# Altium schematic sheet DongHoInternet.SchDoc
size A
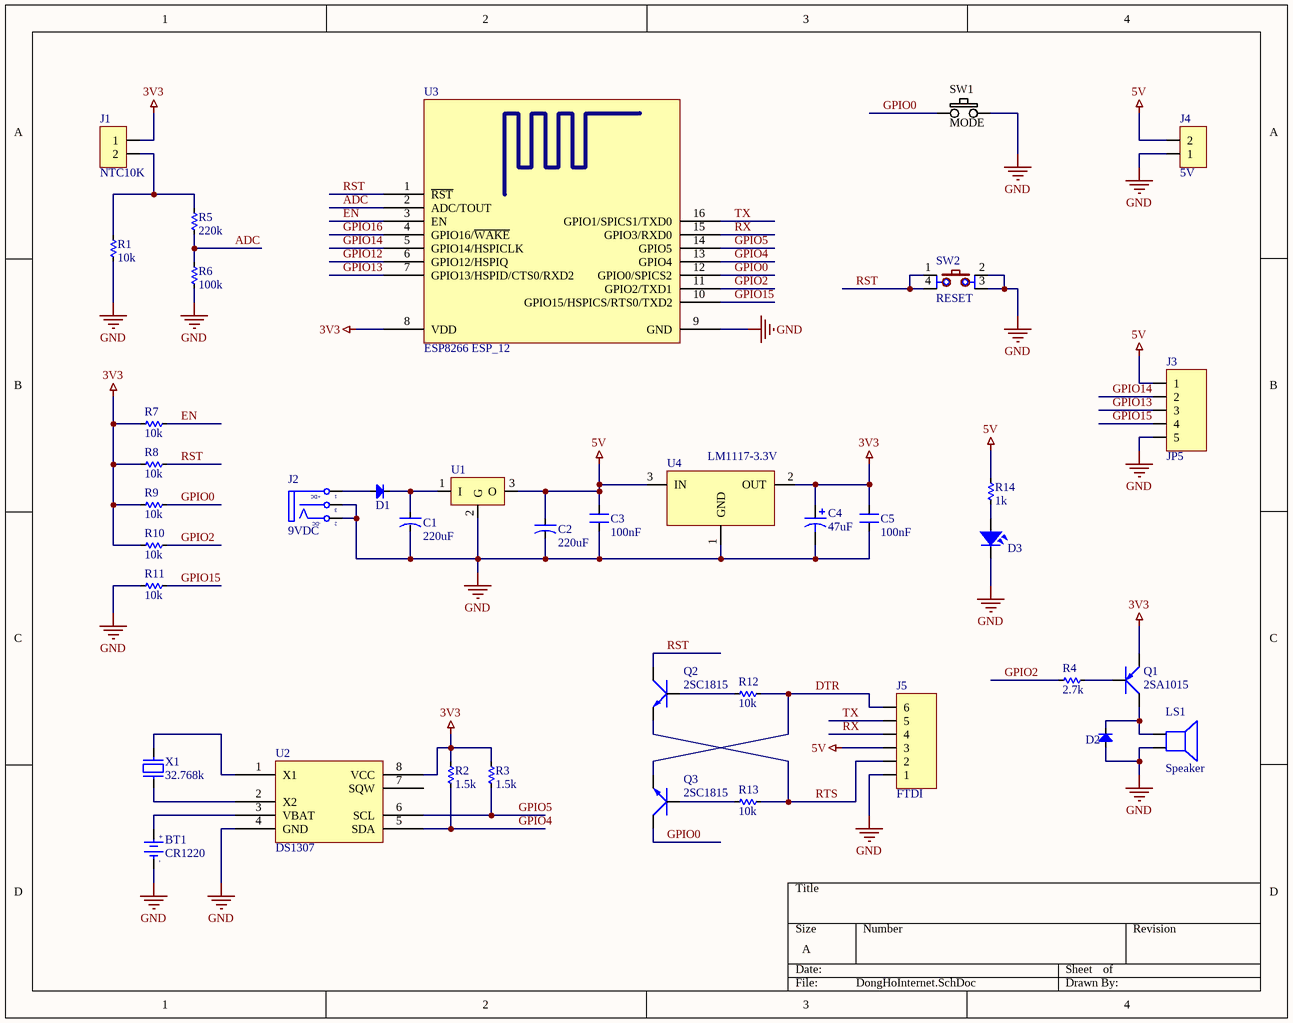
[diagram p0: DongHoInternet.SchDoc]

## Parts
BT1  CR1220  [PIN CR1220]
C1  220uF  [CA-ALU-8]
C2  220uF  [CA-ALU-8]
C3  100nF  [CN-SMD-0805]
C4  47uF  [C5mm]
C5  100nF  [CN-SMD-0805]
D1  Diode SMD  [DIO-SMD-106]  (value not drawn)
D2  Diode SMD  [DIO-SMD-106]  (value not drawn)
D3  P  [LED-0805-Yellow]  (value not drawn)
J1  NTC10K  [JP2-D1T]
J2  9VDC  [DC0]
J3  JP5  [JP5-D1C]
J4  5V  [JP2-D1C]
J5  FTDI  [JP6-D1T]
LS1  Speaker  [SPEAKER]
Q1  2SA1015  [SOT23-321]
Q2  2SC1815  [SOT23-321]
Q3  2SC1815  [SOT23-321]
R1  10k  [RES-SMD-0805]
R2  1.5k  [RES-SMD-0805]
R3  1.5k  [RES-SMD-0805]
R4  2.7k  [RES-SMD-0805]
R5  220k  [RES-SMD-0805]
R6  100k  [RES-SMD-0805]
R7  10k  [RES-SMD-0805]
R8  10k  [RES-SMD-0805]
R9  10k  [RES-SMD-0805]
R10  10k  [RES-SMD-0805]
R11  10k  [RES-SMD-0805]
R12  10k  [RES-SMD-0805]
R13  10k  [RES-SMD-0805]
R14  1k  [RES-SMD-0805]
SW1  MODE  [SW-OMRONRA-Y]
SW2  RESET  [SW2-SMD]
U1  LM78xx  [TO252-123]  (value not drawn)
U2  DS1307  [DS1307]
U3  ESP8266 ESP_12  [ESP8266 ESP_12]
U4  LM1117-3.3V  [SOT223]
X1  32.768k  [XT32k]

## Nets
3V3: C4.1 C5.2 J1.1 Q1.1(E) R2.1 R3.1 R7.1 R8.1 R9.1 R10.1 U2.8(VCC) U3.8(VDD) U4.2(OUT)
5V: C2.1 C3.2 J3.1 J4.2 J5.3 R14.2 U1.3(O) U4.3(IN)
GND: BT1.2(GND) C1.2 C2.2 C3.1 C4.2 C5.1 D2.1(A) D3.2 J2.2(TN) J2.3(S) J3.5 J4.1 J5.1 LS1.2 R1.2 R6.2 R11.1 SW1.1 SW2.2 SW2.3 U1.2(G) U2.4(GND) U3.9(GND) U4.1(GND)
ADC: R5.2 R6.1 U3.2(ADC/TOUT)
DTR: J5.6 Q3.1(E) R12.2
EN: R7.2 U3.3(EN)
GPIO0: Q3.2(C) R9.2 SW1.2 U3.12(GPIO0/SPICS2)
GPIO2: R4.1 R10.2 U3.11(GPIO2/TXD1)
GPIO4: R2.2 U2.5(SDA) U3.13(GPIO4)
GPIO5: R3.2 U2.6(SCL) U3.14(GPIO5)
GPIO12: U3.6(GPIO12/HSPIQ)
GPIO13: J3.3 U3.7(GPIO13/HSPID/CTS0/RXD2)
GPIO14: J3.2 U3.5(GPIO14/HSPICLK)
GPIO15: J3.4 R11.2 U3.10(GPIO15/HSPICS/RTS0/TXD2)
GPIO16: U3.4(GPIO16/~{WAKE})
RST: Q2.2(C) R8.2 SW2.1 SW2.4 U3.1(~{RST})
RTS: J5.2 Q2.1(E) R13.2
RX: J5.4 U3.15(GPIO3/RXD0)
TX: J5.5 U3.16(GPIO1/SPICS1/TXD0)
NetBT1_1: BT1.1(+3V) U2.3(VBAT)
NetC1_1: C1.1 D1.2(K) U1.1(I)
NetD1_1: D1.1(A) J2.1(T)
NetD2_2: D2.2(K) LS1.1 Q1.2(C)
NetD3_1: D3.1 R14.1
NetJ1_2: J1.2 R1.1 R5.1
NetQ1_3: Q1.3(B) R4.2
NetQ2_3: Q2.3(B) R12.1
NetQ3_3: Q3.3(B) R13.1
NetU2_1: U2.1(X1) X1.1
NetU2_2: U2.2(X2) X1.2

Not connected (* = marked no-connect by the designer): U2 7(SQW)

## Notes on the sheet
- (in symbol DCIN) +DC; -DC
- (in symbol PIN CR1220) +; -

## Library data of the parts
BT1 = PIN CR1220
C1 C2 = CN-ALU-DIP: Capacitor (Semiconductor SIM Model); Value: 104; LatestRevisionDate: 17-Jul-2002; LatestRevisionNote: Re-released for DXP Platform.; PackageReference: C1206; Publisher: Altium Limited
C3 C5 = CN: Value: 33pF
C4 = Tu 5mm: Cắm; Value: 8-Jun-2000
D1 D2 = Diode SMD: Default Diode; Code - JEDEC: DO-214-AB; Value: 1N5007; Published: 8-Jun-2000; Revision: July-2002: Re-released for DXP Platform.; Publisher: Altium Limited
D3 = LED SMD: Value: LED 3 - 5 ly 2 Colour
J1 J4 = JP2: WR-PHD 2.54 mm Angled Socket Header; Manufacturer: W¨¹rth Elektronik eiSos GmbH; partNo: 613002143121; ComponentLink1 Description: Manufacturer; ComponentLink2 Description: Datasheet; NoPins: 02; Created Date: 29 March 2013; ComponentLink1URL: http://www.we-online.com; ComponentLink2URL: http://katalog.we-online.de/em/datasheet/6130xx143121.pdf; Created by: Karrer Zheng
J2 = DCIN: Jac DC input; Value: Jac DC
J3 = JP5: WR-PHD 2.54 mm Angled Socket Header; Manufacturer: W¨¹rth Elektronik eiSos GmbH; partNo: 613005143121; ComponentLink1 Description: Manufacturer; ComponentLink2 Description: Datasheet; NoPins: 05; Created Date: 29 March 2013; ComponentLink1URL: http://www.we-online.com; ComponentLink2URL: http://katalog.we-online.de/em/datasheet/6130xx143121.pdf; Created by: Karrer Zheng
J5 = JP6: WR-PHD 2.54 mm Angled Socket Header; Manufacturer: W¨¹rth Elektronik eiSos GmbH; partNo: 613006143121; ComponentLink1 Description: Manufacturer; ComponentLink2 Description: Datasheet; NoPins: 06; Created Date: 29 March 2013; ComponentLink1URL: http://www.we-online.com; ComponentLink2URL: http://katalog.we-online.de/em/datasheet/6130xx143121.pdf; Created by: Karrer Zheng
LS1 = Speaker: Loudspeaker; Published: 24-Mar-1999; LatestRevisionDate: 17-Jul-2002; LatestRevisionNote: Re-released for DXP Platform.; PackageReference: PIN2; Publisher: Altium Limited
Q1 = 2SA1015: PNP 600mW, ECB; Value: A1015
Q2 Q3 = 2SC1815: NPN 600mW, ECB; Value: C1815
R1-R14 = Res-SMD: Resistor; Manufacturer: Generic Components; Class: Passive; Published: 08/06/2000; Publisher: Altium Hobart Technology Centre
SW1 = SW-PB-YELLOW-RA: SW-D6-R / SW-DS-S / SW-14X14 / SW-7X7
SW2 = SW4: Switch button 4 pin; Value: Button chip 4 pin
U1 = LM78xx: Positive Voltage Regulator; Note: Tab is connected to pin 3 (GND).; Published: 24-Aug-2001; LatestRevisionDate: 17-Jul-2002; LatestRevisionNote: Re-released for DXP Platform.; DatasheetVersion: Apr-1994; PackageVersion: Jul-1998; PackageReference: ISOWATT220AB; Publisher: Altium Limited; PackageDescription: TO, Thru-Hole, Vertical, Heatsink Mounted; 3 In-Line Leads; Pitch 2.54 mm; Pin sequence 1, 3, 2; ComponentLink1Description: Manufacturer Link; ComponentLink1URL: http://www.st.com/; ComponentLink2Description: Datasheet; ComponentLink2URL: http://www.st.com/stonline/products/literature/ds/2146/l78m05c.pdf
U3 = ESP8266 ESP_12: ESP8266 ESP-12; IC: ESP8266-EX; Vendor: Ai-thinker; LatestReviewer: Zion Blue; Published: 14-Apr-2015; Publisher: Cynetik Group; LatestRevisionData: 14-Apr-2015; LatestRevisionNote: Include 3D body and Footprint
U4 = LM1117: 800mA Low-Dropout Linear Regulator; Creator: Nguyen Ba Bien; Website: http://group3i.net
X1 = XT2: Crystal, 32.768 KHz, -40 to 85 degC, 3.2 x 1.5 x 0.9 mm SMD; Value: 4Mhz